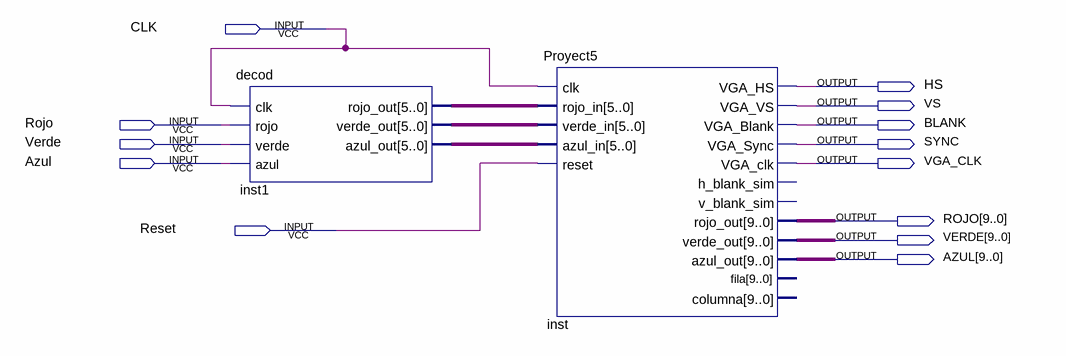
[diagram p0: schematic sheet]
// Quartus schematic a.bdf as structural Verilog: 2 symbols, 13 pins
module a (
  input  CLK,
  input  Rojo_1bit,
  input  Verde_1bit,
  input  Azul_1bit,
  input  Reset,
  output HS,
  output VS,
  output BLANK,
  output SYNC,
  output VGA_CLK,
  output [9:0] Rojo,
  output [9:0] Verde,
  output [9:0] Azul
);

  wire [5:0] inst1_azul_out, inst1_rojo_out, inst1_verde_out;

  decod inst1 (
    .clk(CLK), .rojo(Rojo_1bit), .verde(Verde_1bit), .azul(Azul_1bit), .rojo_out(inst1_rojo_out),
    .verde_out(inst1_verde_out), .azul_out(inst1_azul_out));
  Proyect5 inst (
    .clk(CLK), .rojo_in(inst1_rojo_out), .verde_in(inst1_verde_out), .azul_in(inst1_azul_out), .reset(Reset),
    .VGA_HS(HS), .VGA_VS(VS), .VGA_Blank(BLANK), .VGA_Sync(SYNC), .VGA_clk(VGA_CLK), .rojo_out(Rojo),
    .verde_out(Verde), .azul_out(Azul));  // open: h_blank_sim, v_blank_sim, fila, columna
endmodule
